# EAGLE design controller (EAGLE 5.11)
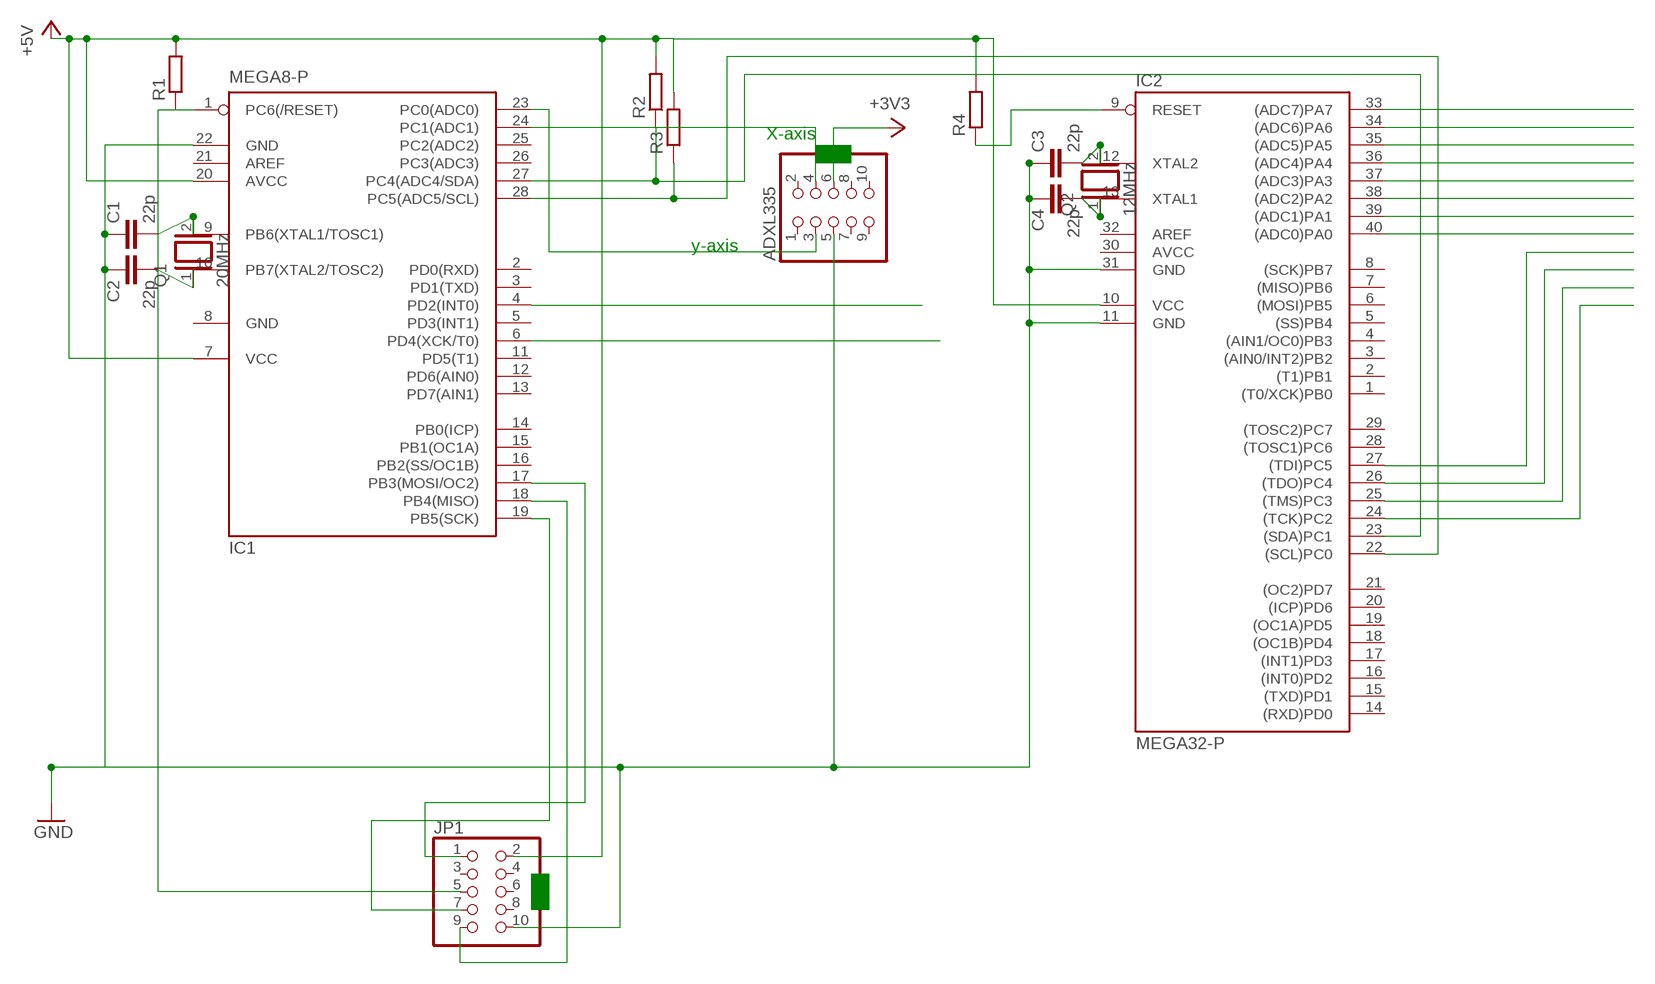
[diagram p0: schematic, sheet 1]

## Parts
ADXL335  PINHD-2X5  [2X05]
C1  22p  C2,5-3  [C2.5-3]
C2  22p  C2,5-3  [C2.5-3]
C3  22p  C2,5-3  [C2.5-3]
C4  22p  C2,5-3  [C2.5-3]
IC1  MEGA8-P  [DIL28-3]
IC2  MEGA32-P  [DIL40]
JP1  PINHD-2X5  [2X05]
Q1  20MHz  XTAL/S  [QS]
Q2  12MHz  XTAL/S  [QS]
R1  R-EU_0207/10  [0207/10]
R2  R-EU_0207/10  [0207/10]
R3  R-EU_0207/10  [0207/10]
R4  R-EU_0207/10  [0207/10]

## Nets
+3V3: ADXL335.6
+5V: IC1.7(VCC) IC1.20(AVCC) IC2.10(VCC) JP1.2 R1.2 R2.2 R3.2 R4.2
GND: ADXL335.5 C1.1 C2.1 C3.1 C4.1 IC1.22(GND) IC2.11(GND) IC2.31(GND) JP1.10
N$1: IC1.28(PC5(ADC5/SCL)) IC2.22((SCL)PC0) R3.1
N$2: IC1.1(PC6(/RESET)) JP1.5 R1.1
N$3: C1.2 IC1.9(PB6(XTAL1/TOSC1)) Q1.2
N$4: C2.2 IC1.10(PB7(XTAL2/TOSC2)) Q1.1
N$5: IC1.27(PC4(ADC4/SDA)) IC2.23((SDA)PC1) R2.1
N$6: ADXL335.3 IC1.23(PC0(ADC0))
N$7: IC2.9(RESET) R4.1
N$8: C3.2 IC2.12(XTAL2) Q2.2
N$9: C4.2 IC2.13(XTAL1) Q2.1
N$10: ADXL335.4 IC1.24(PC1(ADC1))
N$11: IC2.24((TCK)PC2)
N$12: IC2.25((TMS)PC3)
N$13: IC2.26((TDO)PC4)
N$14: IC2.27((TDI)PC5)
N$15: IC2.40((ADC0)PA0)
N$16: IC2.39((ADC1)PA1)
N$17: IC2.38((ADC2)PA2)
N$18: IC2.37((ADC3)PA3)
N$19: IC2.36((ADC4)PA4)
N$20: IC2.35((ADC5)PA5)
N$21: IC2.34((ADC6)PA6)
N$22: IC2.33((ADC7)PA7)
N$33: IC1.4(PD2(INT0))
N$34: IC1.18(PB4(MISO)) JP1.9
N$35: IC1.19(PB5(SCK)) JP1.7
N$36: IC1.6(PD4(XCK/T0))
N$37: IC1.17(PB3(MOSI/OC2)) JP1.1
Unconnected: ADXL335.1 ADXL335.2 ADXL335.7 ADXL335.8 ADXL335.9 ADXL335.10 IC1.2(PD0(RXD)) IC1.3(PD1(TXD)) IC1.5(PD3(INT1)) IC1.11(PD5(T1)) IC1.12(PD6(AIN0)) IC1.13(PD7(AIN1)) IC1.14(PB0(ICP)) IC1.15(PB1(OC1A)) IC1.16(PB2(SS/OC1B)) IC1.21(AREF) IC1.25(PC2(ADC2)) IC1.26(PC3(ADC3)) IC2.1((T0/XCK)PB0) IC2.2((T1)PB1) IC2.3((AIN0/INT2)PB2) IC2.4((AIN1/OC0)PB3) IC2.5((SS)PB4) IC2.6((MOSI)PB5) IC2.7((MISO)PB6) IC2.8((SCK)PB7) IC2.14((RXD)PD0) IC2.15((TXD)PD1) IC2.16((INT0)PD2) IC2.17((INT1)PD3) IC2.18((OC1B)PD4) IC2.19((OC1A)PD5) IC2.20((ICP)PD6) IC2.21((OC2)PD7) IC2.28((TOSC1)PC6) IC2.29((TOSC2)PC7) IC2.32(AREF) JP1.3 JP1.4 JP1.6 JP1.8

## Notes on the sheet
- X-axis
- y-axis

## Power pins joined to a net without a drawn wire
AVCC: IC2.30(AVCC)
GND: IC1.8(GND)

## Library data of the parts
ADXL335 JP1 = pinhead:PINHD-2X5: PIN HEADER
C1-C4 = capacitor-wima:C: CAPACITOR naming: grid - package width
IC1 = atmel:MEGA8-P: MICROCONTROLLER 8 Kbytes FLASH, 1 kbytes SRAM, 512 bytes EEPROM, USART, 4-channel 10 bit ADC, 2-channel 8 bit ADC Pin compatible with Atmega48, ATMega88, ATMega168 Source: avr.lbr
IC2 = atmel:MEGA32-P: MICROCONTROLLER 32 Kbytes FLASH 2 Kbytes SRAM 1 Kbytes EEPROM USART 8-channel 10 bit ADC Source: www.atmel.com .. doc2503.pdf
Q1 Q2 = special:XTAL/S: CRYSTAL
R1-R4 = resistor:R-EU_: RESISTOR, European symbol

## Board
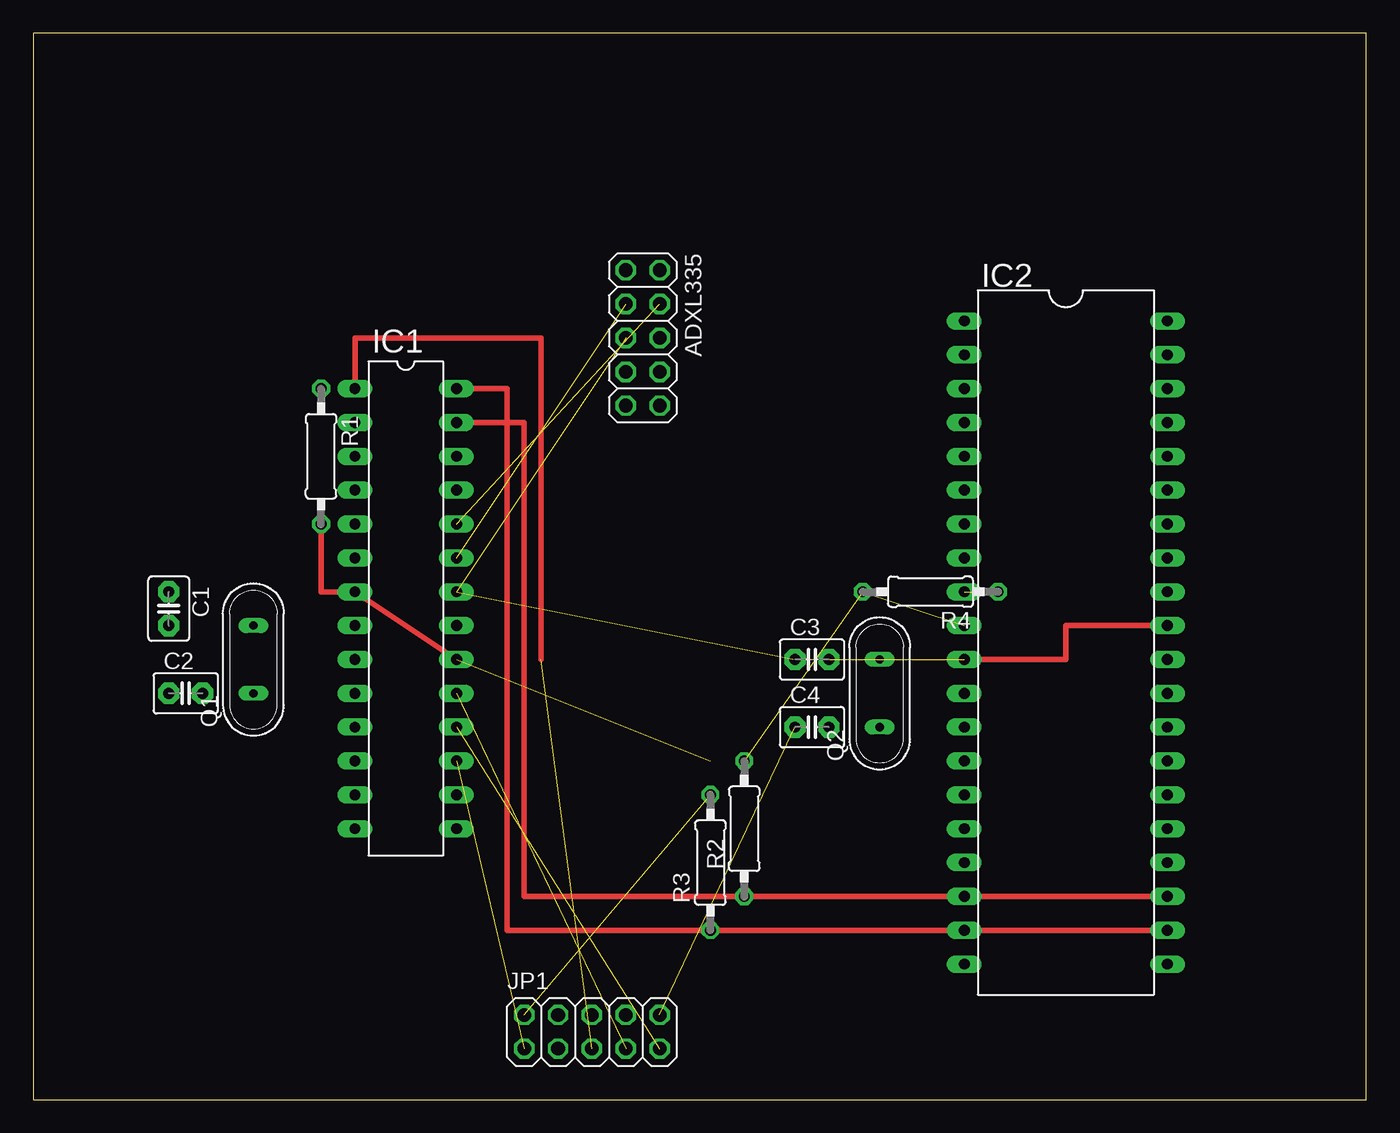
[diagram p1: board, top side]
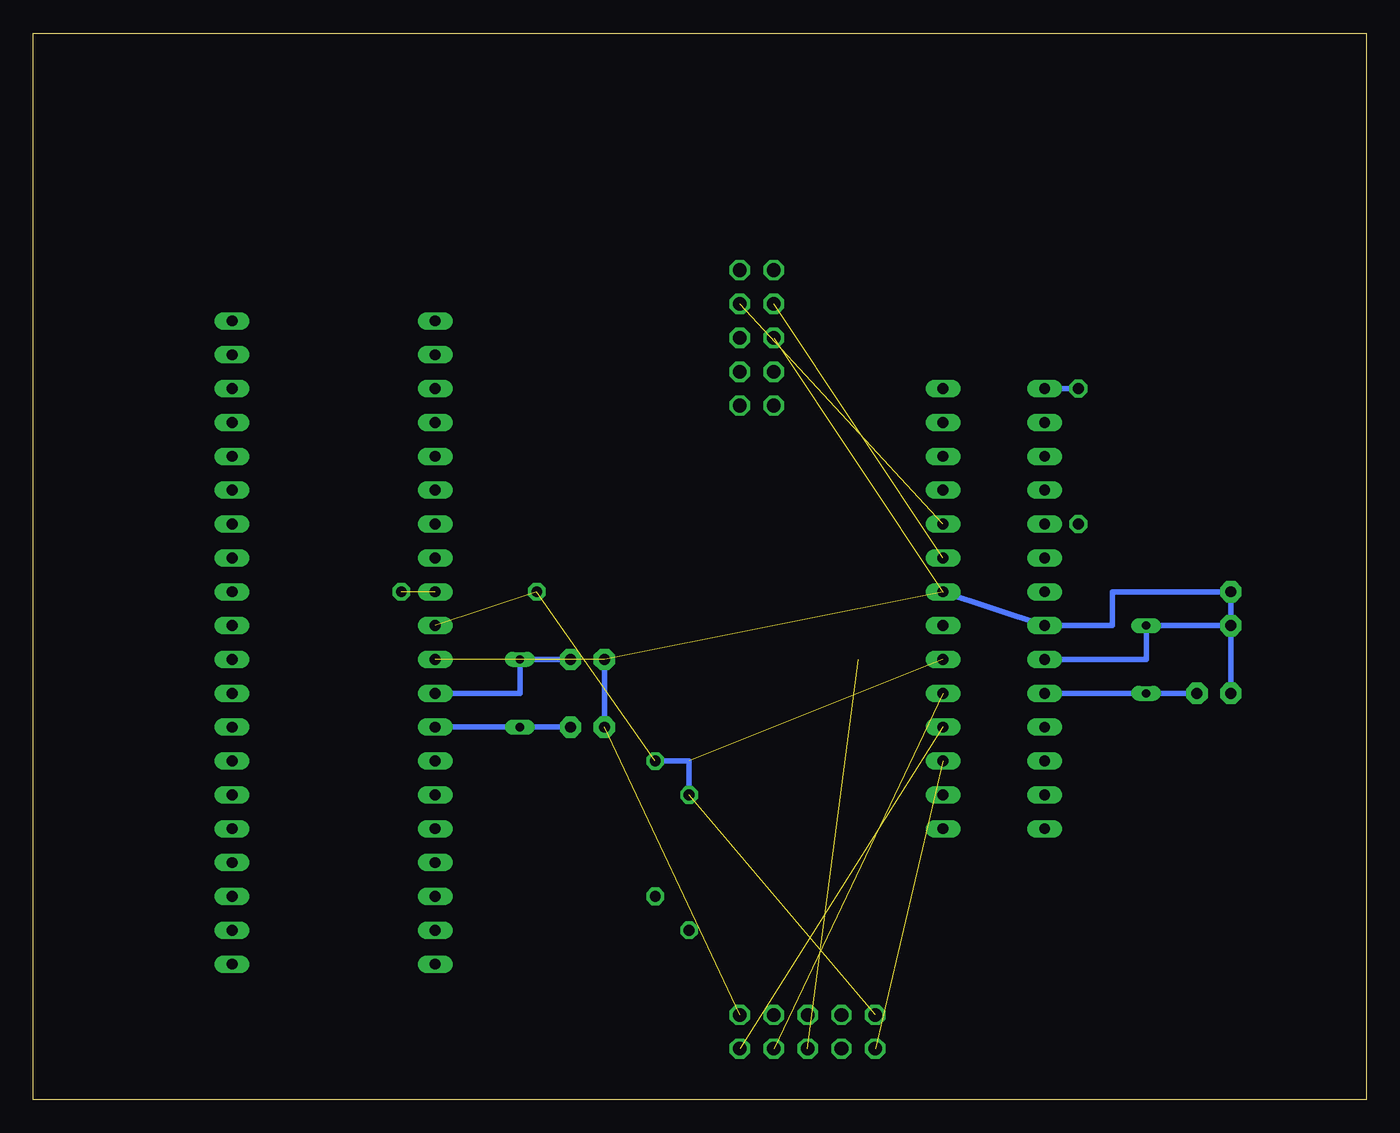
[diagram p2: board, bottom side, seen from below]

Size 100 x 80 mm. Coordinates in mm from the lower left corner, seen from the top.
Outline: 0,0 100,0 100,80 0,80 0,0
Copper layers (1*16): Top 0.035mm / dielectric 1.5mm / Bottom 0.035mm
Design rules "default": minimum track width 10mil, minimum drill 24mil, track to track 8mil, track to pad 8mil, pad to pad 8mil, via to via 8mil, smd to smd 8mil, copper to edge 40mil, drill to drill 8mil, minimum pad ring 10mil, minimum via ring 8mil, stop-mask expansion 4mil, vias tented up to drill 0mil, thermal gap 10mil

### Footprints (pad centres in the part's own frame; a part is rotated, then mirrored left to right if it is on the bottom)
2X05 = drill 1.016 octagon: 1 -5.08,-1.27; 2 -5.08,1.27; 3 -2.54,-1.27; 4 -2.54,1.27; 5 0,-1.27; 6 0,1.27; 7 2.54,-1.27; 8 2.54,1.27; 9 5.08,-1.27; 10 5.08,1.27
C2.5-3 = drill 0.813 pad 1.6 octagon: 1 -1.27,0; 2 1.27,0
DIL28-3 = drill 0.813 long: 1 -16.51,-3.81; 2 -13.97,-3.81; 3 -11.43,-3.81; 4 -8.89,-3.81; 5 -6.35,-3.81; 6 -3.81,-3.81; 7 -1.27,-3.81; 8 1.27,-3.81; 9 3.81,-3.81; 10 6.35,-3.81; 11 8.89,-3.81; 12 11.43,-3.81; 13 13.97,-3.81; 14 16.51,-3.81; 15 16.51,3.81; 16 13.97,3.81; 17 11.43,3.81; 18 8.89,3.81; 19 6.35,3.81; 20 3.81,3.81; 21 1.27,3.81; 22 -1.27,3.81; 23 -3.81,3.81; 24 -6.35,3.81; 25 -8.89,3.81; 26 -11.43,3.81; 27 -13.97,3.81; 28 -16.51,3.81
DIL40 = drill 0.813 long: 1 -24.13,-7.62; 2 -21.59,-7.62; 3 -19.05,-7.62; 4 -16.51,-7.62; 5 -13.97,-7.62; 6 -11.43,-7.62; 7 -8.89,-7.62; 8 -6.35,-7.62; 9 -3.81,-7.62; 10 -1.27,-7.62; 11 1.27,-7.62; 12 3.81,-7.62; 13 6.35,-7.62; 14 8.89,-7.62; 15 11.43,-7.62; 16 13.97,-7.62; 17 16.51,-7.62; 18 19.05,-7.62; 19 21.59,-7.62; 20 24.13,-7.62; 21 24.13,7.62; 22 21.59,7.62; 23 19.05,7.62; 24 16.51,7.62; 25 13.97,7.62; 26 11.43,7.62; 27 8.89,7.62; 28 6.35,7.62; 29 3.81,7.62; 30 1.27,7.62; 31 -1.27,7.62; 32 -3.81,7.62; 33 -6.35,7.62; 34 -8.89,7.62; 35 -11.43,7.62; 36 -13.97,7.62; 37 -16.51,7.62; 38 -19.05,7.62; 39 -21.59,7.62; 40 -24.13,7.62
QS = drill 0.61 long: 1 -2.54,0; 2 2.54,0
0207/10 = drill 0.813 octagon: 1 -5.08,0; 2 5.08,0

### Placement (x,y rotation side)
ADXL335  45.72,57.15 270 top
C1  10.16,36.83 270 top
C2  11.43,30.48 0 top
C3  58.42,33.02 0 top
C4  58.42,27.94 0 top
IC1  27.94,36.83 270 top
IC2  77.47,34.29 270 top
JP1  41.91,5.08 0 top
Q1  16.51,33.02 90 top
Q2  63.5,30.48 90 top
R1  21.59,48.26 270 top
R2  53.34,20.32 90 top
R3  50.8,17.78 90 top
R4  67.31,38.1 180 top

### Tracks (layer width: path | path; a pad name or v marks a point on that pad's centre or on a via)
+5V  (4 unrouted)
  Top 0.406: R1.2 21.59,38.1 IC1.7 IC1.20
  Bottom 0.406: R3.2 50.8,25.4 R2.2
GND  (4 unrouted)
  Top 0.406: IC2.11 77.47,33.02 77.47,35.56 IC2.31
  Bottom 0.406: C2.1 C1.1 19.05,38.1 19.05,35.56 IC1.8 IC1.22 | C4.1 C3.1
N$1
  Top 0.406: IC2.22 R3.1 35.56,12.7 35.56,53.34 IC1.28
N$2  (1 unrouted)
  Top 0.406: 38.1,33.02 38.1,57.15 24.13,57.15 IC1.1
  Bottom 0.406: R1.1 IC1.1
N$3
  Bottom 0.406: C1.2 Q1.2 16.51,33.02 IC1.9
N$4
  Bottom 0.406: IC1.10 Q1.1 C2.2
N$5
  Top 0.406: IC1.27 36.83,50.8 36.83,15.24 R2.1 IC2.23
N$6  (1 unrouted)
N$7  (1 unrouted)
N$8
  Bottom 0.406: C3.2 Q2.2 63.5,30.48 IC2.12
N$9
  Bottom 0.406: IC2.13 Q2.1 C4.2
N$10  (1 unrouted)
N$34  (1 unrouted)
N$35  (1 unrouted)
N$37  (1 unrouted)